# Altium schematic sheet GNSS.SchDoc
size A3; DocumentNumber: 4; SheetNumber: 4; SheetTotal: 4
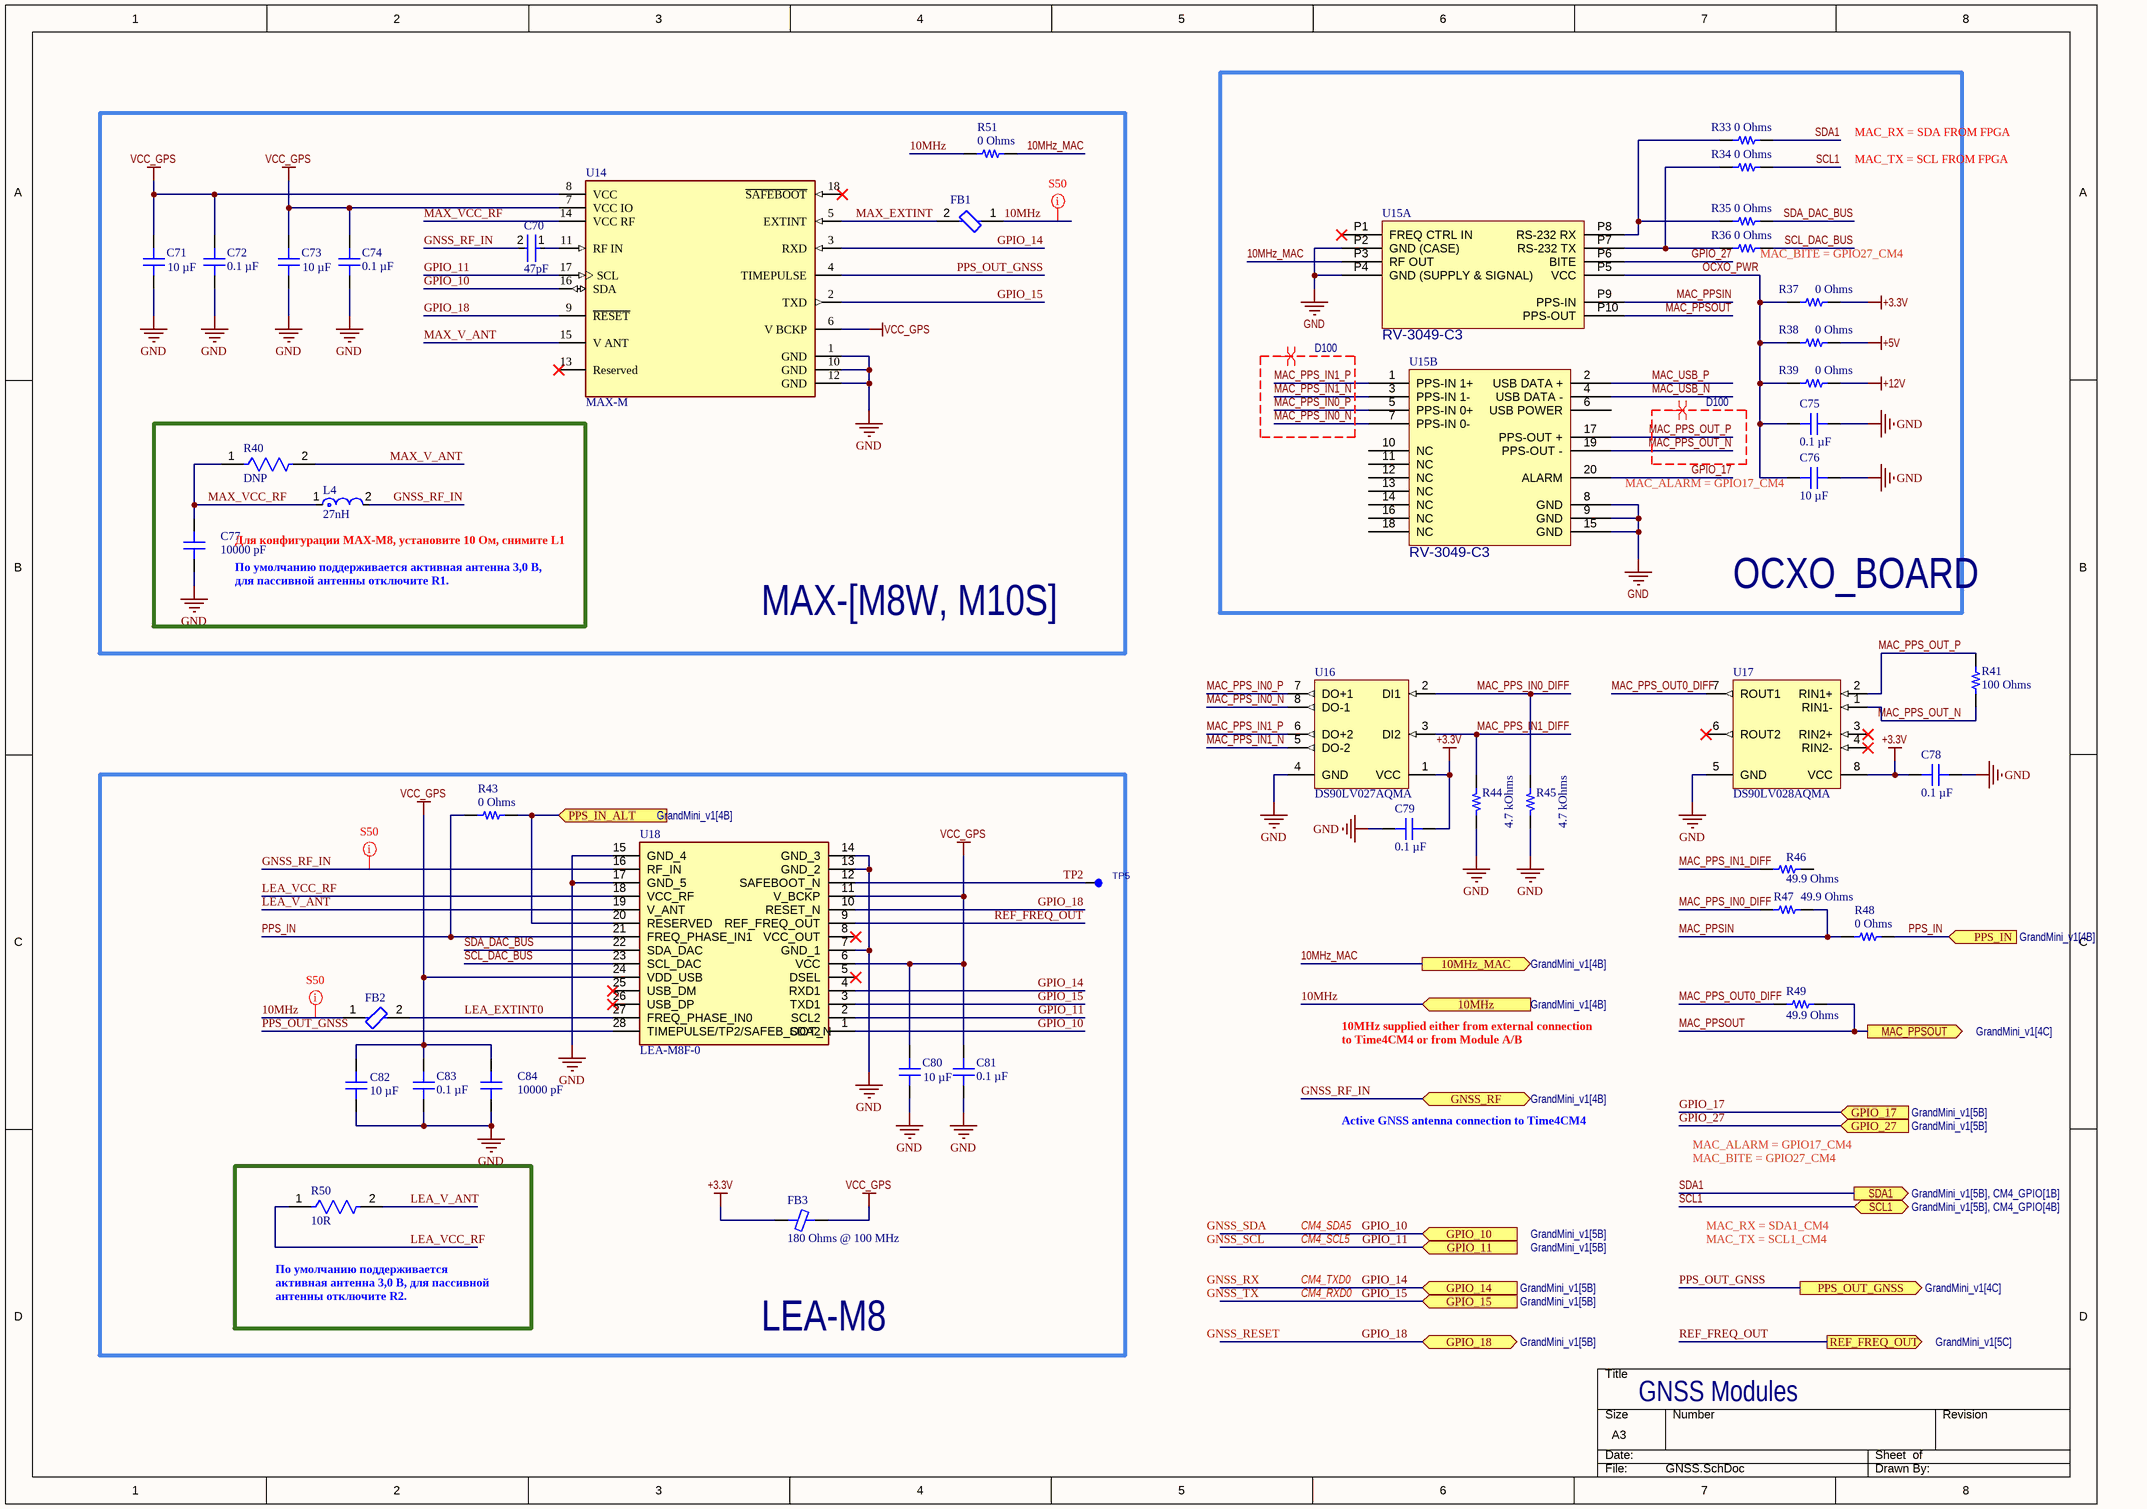
[diagram p0: GNSS.SchDoc]

## Parts
C70  47pF  [FP-C0402-BB-MFG]
C71  10 µF  [CAP 0805_2012]
C72  0.1 µF  [CAP 0603_1608]
C73  Capacitance: 10 µF  [CAP 0805_2012]
C74  0.1 µF  [CAP 0603_1608]
C75  0.1 µF  [CAP 0603_1608]
C76  10 µF  [CAP 0805_2012]
C77  10000 pF  [CAP 0603_1608]
C78  0.1 µF  [CAP 0603_1608]
C79  0.1 µF  [CAP 0603_1608]
C80  10 µF  [CAP 0805_2012]
C81  0.1 µF  [CAP 0603_1608]
C82  10 µF  [CAP 0805_2012]
C83  0.1 µF  [CAP 0603_1608]
C84  10000 pF  [CAP 0603_1608]
FB1  BLM18HG102SH1D  [FP-BLM18-0_15-t0_8-IPC_C]  (value not drawn)
FB2  BLM18HG102SH1D  [FP-BLM18-0_15-t0_8-IPC_C]  (value not drawn)
FB3  180 Ohms @ 100 MHz  [FER 0603_1608]
L4  27nH  [FP-LQG15HH_02-IPC_C]
R33  0 Ohms  [YAGEO RES 0805_2012]
R34  0 Ohms  [YAGEO RES 0805_2012]
R35  0 Ohms  [YAGEO RES 0805_2012]
R36  0 Ohms  [YAGEO RES 0805_2012]
R37  0 Ohms  [YAGEO RES 0805_2012]
R38  0 Ohms  [YAGEO RES 0805_2012]
R39  0 Ohms  [YAGEO RES 0805_2012]
R40  DNP  [FP-ERJ3EK-MFG]
R41  100 Ohms  [YAGEO RES 0603_1608]
R43  0 Ohms  [YAGEO RES 0805_2012]
R44  4.7 kOhms  [YAGEO RES 0402_1005]
R45  4.7 kOhms  [YAGEO RES 0402_1005]
R46  49.9 Ohms  [YAGEO RES 0603_1608]
R47  49.9 Ohms  [YAGEO RES 0603_1608]
R48  0 Ohms  [YAGEO RES 0805_2012]
R49  49.9 Ohms  [YAGEO RES 0603_1608]
R50  10R  [FP-ERJ3EK-MFG]
R51  0 Ohms  [YAGEO RES 0805_2012]
TP5  PAD_TEST  [PAD_TEST]  (value not drawn)  (no BOM)
U14  MAX-M  [FP-MAX-M8W-0-MFG]
U15  value RV-3049-C3  [OCXO_CARD]  (hidden comment: MAC-SA5X)  (parts A,B of 2)
U16  DS90LV027AQMA  [M08A_N]
U17  DS90LV028AQMA  [M08A_L]
U18  LEA-M8F-0  [LEAM8F0]

## Blocks framed on the sheet
MAX-[M8W, M10S]: C70-C74 C77 FB1 L4 R40 R51 U14
OCXO_BOARD: C75 C76 R33-R39 U15
LEA-M8: C80-C84 FB2 FB3 R43 R50 TP5 U18

## Ports
10MHz (in, see GrandMini_v1[4B]), 10MHz_MAC (out, see GrandMini_v1[4B]), GNSS_RF (bidir, see GrandMini_v1[4B]), GPIO_10 (in, see GrandMini_v1[5B]), GPIO_11 (in, see GrandMini_v1[5B]), GPIO_14 (in, see GrandMini_v1[5B]), GPIO_15 (in, see GrandMini_v1[5B]), GPIO_17 (in, see GrandMini_v1[5B]), GPIO_18 (bidir, see GrandMini_v1[5B]), GPIO_27 (in, see GrandMini_v1[5B]), MAC_PPSOUT (out, see GrandMini_v1[4C]), PPS_IN (in, see GrandMini_v1[4B]), PPS_IN_ALT (in, see GrandMini_v1[4B]), PPS_OUT_GNSS (out, see GrandMini_v1[4C]), REF_FREQ_OUT (out, see GrandMini_v1[5C]), SCL1 (bidir, see GrandMini_v1[5B], CM4_GPIO[4B]), SDA1 (out, see GrandMini_v1[5B], CM4_GPIO[1B])

## Nets
+3.3V: C78.1 C79.2 FB3.1 R37.1 U16.1(VCC) U17.8(VCC)
+5V: R38.1
+12V: R39.1
GND: C71.1 C72.1 C73.1 C74.1 C75.2 C76.1 C77.1 C78.2 C79.1 C80.1 C81.1 C82.1 C83.1 C84.1 R44.1 R45.1 U14.1(GND) U14.10(GND) U14.12(GND) U15.8(GND) U15.9(GND) U15.15(GND) U15.P2(GND_(CASE)) U15.P4(GND_(SUPPLY_&_SIGNAL)) U16.4(GND) U17.5(GND) U18.7(GND_1) U18.13(GND_2) U18.14(GND_3) U18.15(GND_4) U18.17(GND_5)
VCC_GPS: C71.2 C72.2 C73.2 C74.2 C80.2 C81.2 C82.2 C83.2 C84.2 FB3.2 U14.6(V_BCKP) U14.7(VCC_IO) U14.8(VCC) U18.6(VCC) U18.11(V_BCKP) U18.24(VDD_USB)
10MHz: FB1.1 FB2.1 R51.1 ; port 10MHz
10MHz_MAC: R51.2 U15.P3(RF_OUT) ; port 10MHz_MAC
GNSS_RF_IN: C70.2 L4.2 U18.16(RF_IN) ; port GNSS_RF
GPIO_10: U14.16(SDA) U18.1(SDA2) ; port GPIO_10
GPIO_11: U14.17(SCL) U18.2(SCL2) ; port GPIO_11
GPIO_14: U14.3(RXD) U18.4(RXD1) ; port GPIO_14
GPIO_15: U14.2(TXD) U18.3(TXD1) ; port GPIO_15
GPIO_17: U15.20(ALARM) ; port GPIO_17
GPIO_18: U14.9(~{RESET}) U18.10(RESET_N) ; port GPIO_18
GPIO_27: U15.P6(BITE) ; port GPIO_27
LEA_EXTINT0: FB2.2 U18.27(FREQ_PHASE_IN0)
LEA_V_ANT: R50.2 U18.19(V_ANT)
LEA_VCC_RF: R50.1 U18.18(VCC_RF)
MAC_PPS_IN0_DIFF: R45.2 R47.1 U16.2(DI1)
MAC_PPS_IN0_N: U15.7(PPS-IN_0-) U16.8(DO-1)
MAC_PPS_IN0_P: U15.5(PPS-IN_0+) U16.7(DO+1)
MAC_PPS_IN1_DIFF: R44.2 R46.1 U16.3(DI2)
MAC_PPS_IN1_N: U15.3(PPS-IN_1-) U16.5(DO-2)
MAC_PPS_IN1_P: U15.1(PPS-IN_1+) U16.6(DO+2)
MAC_PPS_OUT0_DIFF: R49.1 U17.7(ROUT1)
MAC_PPS_OUT_N: R41.1 U15.19(PPS-OUT_-) U17.1(RIN1-)
MAC_PPS_OUT_P: R41.2 U15.17(PPS-OUT_+) U17.2(RIN1+)
MAC_PPSIN: R47.2 R48.1 U15.P9(PPS-IN)
MAC_PPSOUT: R49.2 U15.P10(PPS-OUT) ; port MAC_PPSOUT
MAC_USB_N: U15.4(USB_DATA_-)
MAC_USB_P: U15.2(USB_DATA_+)
MAX_EXTINT: FB1.2 U14.5(EXTINT)
MAX_V_ANT: R40.2 U14.15(V_ANT)
MAX_VCC_RF: C77.2 L4.1 R40.1 U14.14(VCC_RF)
OCXO_PWR: C75.1 C76.2 R37.2 R38.2 R39.2 U15.P5(VCC)
PPS_IN: R43.1 R48.2 U18.21(FREQ_PHASE_IN1) ; port PPS_IN
PPS_IN_ALT: R43.2 U18.20(RESERVED) ; port PPS_IN_ALT
PPS_OUT_GNSS: U14.4(TIMEPULSE) U18.28(TIMEPULSE/TP2/SAFEB_OOT_N) ; port PPS_OUT_GNSS
REF_FREQ_OUT: U18.9(REF_FREQ_OUT) ; port REF_FREQ_OUT
SCL1: R34.1 ; port SCL1
SCL_DAC_BUS: R36.1 U18.23(SCL_DAC)
SDA1: R33.1 ; port SDA1
SDA_DAC_BUS: R35.1 U18.22(SDA_DAC)
TP2: TP5.1 U18.12(SAFEBOOT_N)
NetC70_1: C70.1 U14.11(RF_IN)
NetR33_2: R33.2 R35.2 U15.P8(RS-232_RX)
NetR34_2: R34.2 R36.2 U15.P7(RS-232_TX)

Not connected (* = marked no-connect by the designer): R46 2; U14 13(Reserved)* 18(~{SAFEBOOT})*; U15 6(USB_POWER) 10(NC) 11(NC) 12(NC) 13(NC) 14(NC) 16(NC) 18(NC) P1(FREQ_CTRL_IN)*; U17 3(RIN2+)* 4(RIN2-)* 6(ROUT2)*; U18 5(DSEL)* 8(VCC_OUT)* 25(USB_DM)* 26(USB_DP)*

## Layout directives
net class S50: 10MHz, GNSS_RF_IN
differential pair; differential pair class D100: MAC_PPS_IN0_N, MAC_PPS_IN0_P, MAC_PPS_IN1_N, MAC_PPS_IN1_P, MAC_PPS_OUT_N, MAC_PPS_OUT_P

## Notes on the sheet
- MAC_TX = SCL FROM FPGA
- MAC_RX = SDA FROM FPGA
- (near R36) MAC_BITE = GPIO27_CM4
- MAC_ALARM = GPIO17_CM4
- Для конфигурации MAX-M8, установите 10 Ом, снимите L1
- По умолчанию поддерживается активная антенна 3,0 В, для пассивной антенны отключите R1.
- 10MHz supplied either from external connection to Time4CM4 or from Module A/B
- Active GNSS antenna connection to Time4CM4
- MAC_BITE = GPIO27_CM4
- GNSS_SDA
- GNSS_SCL
- CM4_SDA5
- CM4_SCL5
- MAC_TX = SCL1_CM4
- MAC_RX = SDA1_CM4
- По умолчанию поддерживается активная антенна 3,0 В, для пассивной антенны отключите R2.
- GNSS_RX
- GNSS_TX
- CM4_TXD0
- CM4_RXD0
- GNSS_RESET
- GNSS Modules
- DWG. NO.
- REV.
- SHT.
- REVISION
- DESCRIPTION
- DATE
- APPROVED
- THIS DOCUMENT AND THE DATA DISCLOSED HEREIN OR HEREWITH IS THE PROPERTY OF ALTIUM LIMITED AND MAY BE FREELY DISTRIBUTED IN WHOLE. NO RIGHTS ARE RESERVED OR EXPRESS OR IMPLIED WARANTEE GIVEN.
- ENG:
- DSN:
- APPROVALS
- PROJECT
- DOCUMENT REVISION:
- DESIGN ITEM:
- CHK:
- BOM:
- REFERENCE DOCUMENTS
- PROJECT REVISION:
- TITLE
- FAB DWG:
- PCB DWG:
- ASSY DWG:
- SCALE:
- SIZE
- C
- CAGE CODE
- FILE NAME
- DWG NO.
- SHEET
- OF
- REV

## Library data of the parts
C70 = CMP-2008-03364-2: CAP CER 47PF 25V 5% NP0 0402; Manufacturer Part Number: C0402C470J3GACTU; Manufacturer: Kemet; Material: Ceramic; Temperature Coefficient: 15%; Temperature Characteristic: C0G; Tolerance: 0.05; RoHS: TRUE; Category: Cap; Device Class L1: Passive Components; Device Class L3: Ceramic Capacitors; Voltage Rating: 25 V; Automotive: No; Octopart: https://octopart.com/c0402c470j3gactu-kemet-9139794; Value: 47 pF; Package: C0402-BB; Temperature: -55°C to +125°C; Mouser Description: Multilayer Ceramic Capacitors MLCC - SMD/SMT 25volts 47pF C0G 5%; Temperature Range Low: -55°C; Temperature Range High: +125°C; Lead Free: Yes; Capacitance: 47 pF; Digikey Description: CAP CER 47PF 25V 5% NP0 0402; Device Class L2: Capacitors; ComponentLink2URL: https://content.kemet.com/datasheets/KEM_C1002_X7R_SMD.pdf; Height: 0.55mm; ComponentLink2Description: Datasheet; Ipc Land Pattern Name: CAPC10050X50
C71 C76 C80 C82 = CC0805KKX5R8BB106: CAP CER 10UF 25V X5R 0805; manufacturer: Yageo; Tolerance: ±10%; series: CC; packaging: TapeAndReel; Capacitance: 10 µF; Part Number: CC0805KKX5R8BB106; Applications: General Purpose; componentlink1description: Datasheet; componentlink1url: https://www.yageo.com/upload/media/product/productsearch/datasheet/mlcc/UPY-GPHC_X5R_4V-to-50V_25.pdf; componentlink2description: DigiKey Link; componentlink2url: https://www.digikey.com/en/products/detail/yageo/CC0805KKX5R8BB106/5195275; Device Package: 0805 (2012 Metric); lastupdated: 09.02.2024 20:15:28; Lifecycle Status: Active; Minimum Order: 1; Mounting Type: Surface Mount, MLCC; Operating Temperature: -55°C ~ 85°C; Package / Case: 0805 (2012 Metric); partid: 16151; Part Status: Active; price: 0.06; Size / Dimension: 0.079" L x 0.049" W (2.00mm x 1.25mm); Supplier 1: DigiKey; Supplier Part Number 1: 311-1869-1-ND; Temperature Coefficient: X5R; Thickness (Max): 0.057" (1.45mm); Voltage - Rated: 25V; Value: 10 µF
C72 C74 C75 C78 C79 C81 C83 = CC0603KRX7R9BB104: CAP CER 0.1UF 50V X7R 0603; manufacturer: Yageo; Tolerance: ±10%; componentlink2url: https://www.digikey.com/en/products/detail/yageo/CC0603KRX7R9BB104/2103082; Value: 0.1 µF; componentlink2description: DigiKey Link; Temperature Coefficient: X7R; Capacitance: 0.1 µF; Part Number: CC0603KRX7R9BB104; Applications: General Purpose; componentlink1description: Datasheet; componentlink1url: https://www.yageo.com/upload/media/product/productsearch/datasheet/mlcc/UPY-GPHC_X7R_6.3V-to-50V_18.pdf; Device Package: 0603 (1608 Metric); lastupdated: 09.02.2024 20:10:21; Lifecycle Status: Active; Minimum Order: 1; Mounting Type: Surface Mount, MLCC; Operating Temperature: -55°C ~ 125°C; Package / Case: 0603 (1608 Metric); packaging: TapeAndReel; partid: 9506; Part Status: Active; price: 0.01; series: CC; Size / Dimension: 0.063" L x 0.031" W (1.60mm x 0.80mm); Supplier 1: DigiKey; Supplier Part Number 1: 311-1344-1-ND; Thickness (Max): 0.035" (0.90mm); Voltage - Rated: 50V
C73 = CC0805KKX5R8BB106: CAP CER 10UF 25V X5R 0805; manufacturer: Yageo; Tolerance: ±10%; Value: 10 µF; series: CC; packaging: TapeAndReel; Part Number: CC0805KKX5R8BB106; Applications: General Purpose; componentlink1description: Datasheet; componentlink1url: https://www.yageo.com/upload/media/product/productsearch/datasheet/mlcc/UPY-GPHC_X5R_4V-to-50V_25.pdf; componentlink2description: DigiKey Link; componentlink2url: https://www.digikey.com/en/products/detail/yageo/CC0805KKX5R8BB106/5195275; Device Package: 0805 (2012 Metric); lastupdated: 09.02.2024 20:15:28; Lifecycle Status: Active; Minimum Order: 1; Mounting Type: Surface Mount, MLCC; Operating Temperature: -55°C ~ 85°C; Package / Case: 0805 (2012 Metric); partid: 16151; Part Status: Active; price: 0.06; Size / Dimension: 0.079" L x 0.049" W (2.00mm x 1.25mm); Supplier 1: DigiKey; Supplier Part Number 1: 311-1869-1-ND; Temperature Coefficient: X5R; Thickness (Max): 0.057" (1.45mm); Voltage - Rated: 25V
C77 C84 = CC0603KRX7R9BB103: CAP CER 10000PF 50V X7R 0603; manufacturer: Yageo; Tolerance: ±10%; Part Number: CC0603KRX7R9BB103; Supplier 1: DigiKey; Supplier Part Number 1: 311-1085-1-ND; Capacitance: 10000 pF; packaging: TapeAndReel; series: CC; componentlink1url: https://www.yageo.com/upload/media/product/productsearch/datasheet/mlcc/UPY-GPHC_X7R_6.3V-to-50V_18.pdf; componentlink1description: Datasheet; componentlink2url: https://www.digikey.com/en/products/detail/yageo/CC0603KRX7R9BB103/302819; componentlink2description: DigiKey Link; Value: 10000 pF; Applications: General Purpose; Device Package: 0603 (1608 Metric); lastupdated: 09.02.2024 20:10:06; Lifecycle Status: Active; Minimum Order: 1; Mounting Type: Surface Mount, MLCC; Operating Temperature: -55°C ~ 125°C; Package / Case: 0603 (1608 Metric); partid: 17848; Part Status: Active; price: 0.01; Size / Dimension: 0.063" L x 0.031" W (1.60mm x 0.80mm); Temperature Coefficient: X7R; Thickness (Max): 0.035" (0.90mm); Voltage - Rated: 50V
FB1 FB2 = CMP-06046-001255-1: Chip Ferrite Bead, 0603, 1000Ω @ 100MHz, 1.6Ω, 25%, 100mA; Number of Circuits: 1; DC Resistance (DCR): 1.6R; Shielding: Unshielded; Impedance: 1kR; Max Current Rating: 100mA; Case Code (Metric): 1608; Number of Lines: 1; Ratings: AEC-Q200; Test Frequency: 100MHz; Case Code (Imperial): 0603; Min Operating Temperature: -55°C; Height: 0.037inch; Contact Plating: Tin; Package Quantity: 4000; Width: 0.8mm; Packaging: Tape and Reel; Mount: Surface Mount; Case/Package: 0603; Max Operating Temperature: 125°C; Length: 1.6mm; Max DC Current: 100mA; Tolerance: 25%; Termination: SMD/SMT
FB3 = BLM18PG181SN1D: FERRITE BEAD 180 OHM 0603 1LN; Manufacturer: Murata Electronics; Current Rating (Max): 1.5A; DC Resistance (DCR) (Max): 90mOhm; Filter Type: Power Line; Number of Lines: 1; Part Number: BLM18PG181SN1D; ComponentLink1Description: Datasheet; ComponentLink1URL: https://www.murata.com/en-us/products/productdata/8796738650142/ENFA0003.pdf; ComponentLink2Description: DigiKey Link; ComponentLink2URL: https://www.digikey.com/en/products/detail/murata-electronics/BLM18PG181SN1D/1634634; Device Package: 0603 (1608 Metric); Height (Max): 0.037" (0.95mm); Impedance @ Frequency: 180 Ohms @ 100 MHz; LastUpdated: 03.06.2024 19:51:52; Lifecycle Status: Active; Minimum Order: 1; Mounting Type: Surface Mount; Operating Temperature: -55°C ~ 125°C; Package / Case: 0603 (1608 Metric); Packaging: TapeAndReel; PartId: 858; Part Status: Active; Price: 0.02; Series: EMIFIL®, BLM18; Size / Dimension: 0.063" L x 0.032" W (1.60mm x 0.80mm); Supplier 1: DigiKey; Supplier Part Number 1: 490-5263-1-ND; Value: 180 Ohms @ 100 MHz
L4 = CMP-2000-06578-2: Multilayer type RF Inductor 27nH ±5% 0.46Ω 350mA 0402; DC Current: 300mA; Core Material: Air; Self Resonant Frequency: 1.7GHz; Q Factor: 8; DC Resistance (DCR): 460mR; Shielding: Unshielded; Test Frequency: 100MHz; Inductance: 27nH; Width: 0.02inch; Length: 1mm; Height - Seated (Max): 0.022inch; Military Standard: Not; Case Code (Imperial): 0402; Tolerance: 5%; Depth: 0.55mm; Current Rating: 300mA; Inductance Tolerance: 5%; Lead Free: Lead Free; Height: 0.5mm; Max DC Current: 300mA; REACH SVHC: No SVHC; Package Quantity: 10000; Mount: Surface Mount; Termination: SMD/SMT; Case Code (Metric): 1005; Case/Package: 0402; Max Operating Temperature: 125°C; Packaging: Tape and Reel; Min Operating Temperature: -55°C
R33-R39 R43 R48 R51 = RC0805FR-070RL: RES 0 OHM JUMPER 1/8W 0805; Manufacturer: Yageo; Power (Watts): 0.125W, 1/8W; Value: 0 Ohms; Part Number: RC0805FR-070RL; ComponentLink1Description: Datasheet; ComponentLink1URL: https://www.yageo.com/upload/media/product/productsearch/datasheet/rchip/PYu-RC_Group_51_RoHS_L_10.pdf; ComponentLink2Description: DigiKey Link; ComponentLink2URL: https://www.digikey.com/en/products/detail/yageo/RC0805FR-070RL/2827620; Composition: Thick Film; Device Package: 0805 (2012 Metric); Features: Moisture Resistant; Height - Seated (Max): 0.024" (0.60mm); LastUpdated: 25.07.2024 9:20:16; Lifecycle Status: Active; Minimum Order: 1; Number of Terminations: 2; Operating Temperature: -55°C ~ 155°C; Package / Case: 0805 (2012 Metric); Packaging: CutTape; PartId: 47635; Part Status: Active; Price: 0.01; Resistance: 0 Ohms; Series: RC_L; Size / Dimension: 0.079" L x 0.049" W (2.00mm x 1.25mm); Supplier 1: DigiKey; Supplier Part Number 1: 311-0.0CRCT-ND; Supplier Device Package: 0805; Tolerance: Jumper
R40 R50 = CMP-2000-00195-2: RES SMD 10 OHM 1% 1/10W 0603; Manufacturer Part Number: ERJ-3EKF10R0V; Manufacturer: Panasonic; Resistance: 10Ω; Voltage Rating: 75V; Value: 10Ω; Power: 100mW; Power Rating: 0.1W; Temperature Coefficient: 100ppm/°C; Automotive Grade: Grade 0; Lead Free: Yes; Device Class L1: Passive Components; Digikey Description: RES SMD 10 OHM 1% 1/10W 0603; Octopart: https://octopart.com/erj-3ekf10r0v-panasonic-55403649; Automotive: Yes; ComponentLink2URL: https://b2b-api.panasonic.eu/file_stream/pids/fileversion/1263; Height: 0.55mm; Temperature Range High: +155°C; Footprint Url: https://industrial.panasonic.com/cdbs/www-data/pdf/RDA0000/DMA0000COL17.pdf; Temperature: -55°C to +155°C; Tolerance: 1%; ComponentLink2Description: Datasheet; Package: ERJ3EK; Device Class L2: Resistors; Category: Res; Ipc Land Pattern Name: RESC16080X45; RoHS: TRUE; Composition: Thick Film; Device Class L3: Chip SMD Resistors; Temperature Range Low: -55°C; Series: ERJ
R41 = RC0603FR-07100RL: RES 100 OHM 1% 1/10W 0603; Manufacturer: Yageo; Power (Watts): 0.1W, 1/10W; Temperature Coefficient: ±100ppm/°C; Packaging: CutTape; ComponentLink2Description: DigiKey Link; ComponentLink1Description: Datasheet; ComponentLink2URL: https://www.digikey.com/en/products/detail/yageo/RC0603FR-07100RL/726888; ComponentLink1URL: https://www.yageo.com/upload/media/product/productsearch/datasheet/rchip/PYu-RC_Group_51_RoHS_L_10.pdf; Part Number: RC0603FR-07100RL; Value: 100 Ohms; Composition: Thick Film; Device Package: 0603 (1608 Metric); Features: Moisture Resistant; Height - Seated (Max): 0.022" (0.55mm); LastUpdated: 25.07.2024 9:19:19; Lifecycle Status: Active; Minimum Order: 1; Number of Terminations: 2; Operating Temperature: -55°C ~ 155°C; Package / Case: 0603 (1608 Metric); PartId: 22598; Part Status: Active; Price: 0.01; Resistance: 100 Ohms; Series: RC_L; Size / Dimension: 0.063" L x 0.031" W (1.60mm x 0.80mm); Supplier 1: DigiKey; Supplier Part Number 1: 311-100HRCT-ND; Supplier Device Package: 0603; Tolerance: ±1%
R44 R45 = RC0402FR-074K7L: RES 4.7K OHM 1% 1/16W 0402; Manufacturer: Yageo; Temperature Coefficient: ±100ppm/°C; Power (Watts): 0.063W, 1/16W; Series: RC_L; Resistance: 4.7 kOhms; Packaging: CutTape; Tolerance: ±1%; Part Number: RC0402FR-074K7L; Value: 4.7 kOhms; ComponentLink1Description: Datasheet; ComponentLink1URL: https://www.yageo.com/upload/media/product/productsearch/datasheet/rchip/PYu-RC_Group_51_RoHS_L_10.pdf; ComponentLink2Description: DigiKey Link; ComponentLink2URL: https://www.digikey.com/en/products/detail/yageo/RC0402FR-074K7L/2827563; Composition: Thick Film; Device Package: 0402 (1005 Metric); Features: Moisture Resistant; Height - Seated (Max): 0.016" (0.40mm); LastUpdated: 25.07.2024 9:18:11; Lifecycle Status: Active; Minimum Order: 1; Number of Terminations: 2; Operating Temperature: -55°C ~ 155°C; Package / Case: 0402 (1005 Metric); PartId: 17603; Part Status: Active; Price: 0.01; Size / Dimension: 0.039" L x 0.020" W (1.00mm x 0.50mm); Supplier 1: DigiKey; Supplier Part Number 1: 311-4.7KLRCT-ND; Supplier Device Package: 0402
R46 R47 R49 = RC0603FR-0749R9L: RES 49.9 OHM 1% 1/10W 0603; Manufacturer: Yageo; Power (Watts): 0.1W, 1/10W; Temperature Coefficient: ±100ppm/°C; Packaging: CutTape; ComponentLink2Description: DigiKey Link; ComponentLink1Description: Datasheet; ComponentLink2URL: https://www.digikey.com/en/products/detail/yageo/RC0603FR-0749R9L/727264; ComponentLink1URL: https://www.yageo.com/upload/media/product/productsearch/datasheet/rchip/PYu-RC_Group_51_RoHS_L_10.pdf; Part Number: RC0603FR-0749R9L; Value: 49.9 Ohms; Composition: Thick Film; Device Package: 0603 (1608 Metric); Features: Moisture Resistant; Height - Seated (Max): 0.022" (0.55mm); LastUpdated: 25.07.2024 9:19:17; Lifecycle Status: Active; Minimum Order: 1; Number of Terminations: 2; Operating Temperature: -55°C ~ 155°C; Package / Case: 0603 (1608 Metric); PartId: 23951; Part Status: Active; Price: 0.01; Resistance: 49.9 Ohms; Series: RC_L; Size / Dimension: 0.063" L x 0.031" W (1.60mm x 0.80mm); Supplier 1: DigiKey; Supplier Part Number 1: 311-49.9HRCT-ND; Supplier Device Package: 0603; Tolerance: ±1%
TP5 = PAD_TEST: Test Point; Manufacturer: {Manufacturer}; Reseller3: {Reseller3}; Reseller1: {Reseller1}; Tempcoeff: {Tempcoeff}; Reseller2: {Reseller2}; Tolerance: {Tolerance}; Value: .NetName; PowerVoltage: {PowerVoltage}; CatalogueCode: {CatalogueCode}; Case: {Case}
U14 = CMP-207130-000023-1: RF RCVR GNSS/GPS 1.575GHZ 18LCC; Current - Receiving: 23mA; Interface: I2C; Sensitivity: -167dBm; Frequency: 1.575GHz; Min Operating Temperature: -40°C; Packaging: Tape and Reel; RoHS Compliant: Yes; Max Operating Temperature: 85°C; Case/Package: SMD/SMT
U15 = MAC-SA5X: MOD, MAC, MAC-SA5X, ATOMIC CLOCK; VELENTIUM PART NUM: <V PART NUM>; MFG NAME: MICROCHIP; MAXTEMP: 85C; MINTEMP: -40C; OTHER: AEC-Q200; MODIFY DATE: 3/22/2006 1:36:44 PM; MFG PART NUM: MAC-SA5X; CATEGORY: MOD; P1: ATOMIC CLOCK; SHEETPART: *; DESC: MOD, MAC, MAC-SA5X, ATOMIC CLOCK
U16 = CMP-0058-01000-2: Automotive LVDS Dual Differential Driver, 8-pin Narrow SOIC; Manufacturer: National Semiconductor; PackageTopMarking: NSZXTT*90LV0*27AQM; CompType: Interface IC; PowerWise: N; DatasheetVersion: Oct-2008; PinCount: 8; RevisionNote: Component URLs added; Code_IPC: SOIC127P600-8; ComponentLink1URL: http://www.national.com/ds/DS/DS90LV027AQ.pdf; ComponentLink3Description: M08A Package Page; PackageDescription: SOIC Narrow, 4.9 x 3.9 x 1.45mm, 8 Lead, 1.27mm Pitch; ComponentLink2Description: DS90LV027AQ Web Page; ComponentLink2URL: http://www.national.com/pf/DS/DS90LV027AQ.html; RoHS: Y; Code_JEDEC: MS-012-AA; PackageReference: M08A; PackageVersion: revM, May-2009; ComponentLink1Description: DS90LV027AQ Datasheet; ComponentLink3URL: http://www.national.com/packaging/folders/m08a.html
U17 = CMP-0058-01010-2: Automotive LVDS Dual Differential Line Receiver, 8-pin Narrow SOIC; Manufacturer: National Semiconductor; PowerWise: N; PackageTopMarking: NSZXTT*90LV0*28AQM; CompType: Interface IC; DatasheetVersion: Oct-2008; PackageReference: M08A; RevisionNote: Component URLs added; Code_JEDEC: MS-012-AA; PackageVersion: revM, May-2009; ComponentLink1URL: http://www.national.com/ds/DS/DS90LV028AQ.pdf; PinCount: 8; ComponentLink3Description: M08A Package Page; ComponentLink1Description: DS90LV028AQ Datasheet; Code_IPC: SOIC127P600-8; RoHS: Y; ComponentLink2URL: http://www.national.com/pf/DS/DS90LV028AQ.html; PackageDescription: SOIC Narrow, 4.9 x 3.9 x 1.45mm, 8 Lead, 1.27mm Pitch; ComponentLink2Description: DS90LV028AQ Web Page; ComponentLink3URL: http://www.national.com/packaging/folders/m08a.html
U18 = LEA-M8F-0: Integrated Circuit; Manufacturer_Name: u-blox; Datasheet Link: https://content.u-blox.com/sites/default/files/documents/LEA-M8F_DataSheet_UBX-14001772.pdf; Height: 3.9mm; Manufacturer_Part_Number: LEA-M8F-0; Mouser Part Number: 377-LEA-M8F-0; Mouser Price/Stock: https://www.mouser.co.uk/ProductDetail/u-blox/LEA-M8F-0?qs=KUoIvG%2F9IlbqimLgpKzp4A%3D%3D